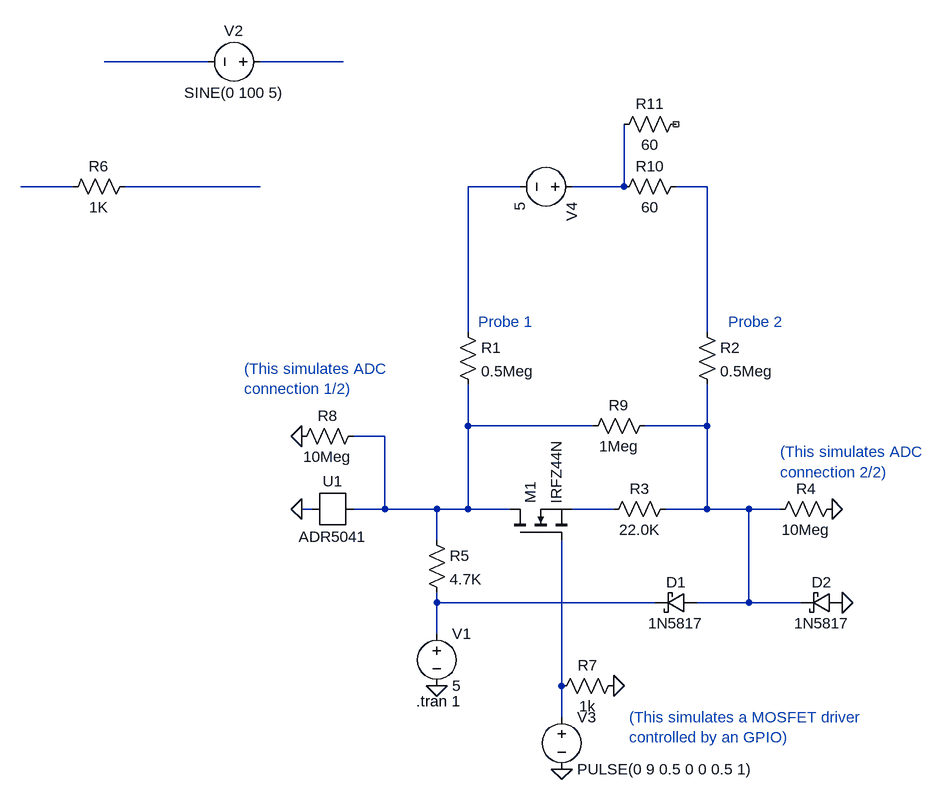
[diagram p0: schematic Voltmeter W Continuity.asc]
Voltmeter W Continuity.asc, the LTspice schematic file:
Version 4
SHEET 1 880 680
WIRE -384 -752 -544 -752
WIRE -176 -752 -304 -752
WIRE -592 -560 -672 -560
WIRE -304 -560 -512 -560
WIRE 96 -560 16 -560
WIRE 256 -560 256 -656
WIRE 256 -560 176 -560
WIRE 384 -560 336 -560
WIRE 16 -336 16 -560
WIRE 384 -336 384 -560
WIRE 16 -192 16 -256
WIRE 208 -192 16 -192
WIRE 384 -192 384 -256
WIRE 384 -192 288 -192
WIRE -112 -176 -160 -176
WIRE -224 -64 -240 -64
WIRE -112 -64 -112 -176
WIRE -112 -64 -160 -64
WIRE -32 -64 -112 -64
WIRE 16 -64 16 -192
WIRE 16 -64 -32 -64
WIRE 80 -64 16 -64
WIRE 240 -64 176 -64
WIRE 384 -64 384 -192
WIRE 384 -64 320 -64
WIRE 448 -64 384 -64
WIRE 496 -64 448 -64
WIRE -32 -16 -32 -64
WIRE -32 80 -32 64
WIRE 304 80 -32 80
WIRE 448 80 448 -64
WIRE 448 80 368 80
WIRE 528 80 448 80
WIRE -32 128 -32 80
WIRE 160 208 160 -16
WIRE 160 256 160 208
FLAG -32 208 0
FLAG 576 -64 0
FLAG -240 -64 0
FLAG 592 80 0
FLAG 240 208 0
FLAG 160 336 0
FLAG -240 -176 0
SYMBOL voltage -32 112 R0
WINDOW 123 0 0 Left 0
WINDOW 39 0 0 Left 0
SYMATTR InstName V1
SYMATTR Value 5
SYMBOL res 0 -352 R0
SYMATTR InstName R1
SYMATTR Value 0.5Meg
SYMBOL res 368 -352 R0
SYMATTR InstName R2
SYMATTR Value 0.5Meg
SYMBOL res 224 -48 R270
WINDOW 0 32 56 VTop 2
WINDOW 3 0 56 VBottom 2
SYMATTR InstName R3
SYMATTR Value 22.0K
SYMBOL res 592 -80 R90
WINDOW 0 0 56 VBottom 2
WINDOW 3 32 56 VTop 2
SYMATTR InstName R4
SYMATTR Value 10Meg
SYMBOL References\\ADR5041 -192 -64 R90
WINDOW 3 27 0 VTop 2
WINDOW 0 -27 0 VBottom 2
SYMATTR InstName U1
SYMBOL voltage -288 -752 R90
WINDOW 0 -32 56 VBottom 2
WINDOW 3 32 56 VTop 2
WINDOW 123 0 0 Left 0
WINDOW 39 0 0 Left 0
SYMATTR InstName V2
SYMATTR Value SINE(0 100 5)
SYMBOL res -48 -32 R0
SYMATTR InstName R5
SYMATTR Value 4.7K
SYMBOL schottky 368 64 R90
WINDOW 0 0 32 VBottom 2
WINDOW 3 32 32 VTop 2
SYMATTR InstName D1
SYMATTR Value 1N5817
SYMATTR Description Diode
SYMATTR Type diode
SYMBOL schottky 592 64 R90
WINDOW 0 0 32 VBottom 2
WINDOW 3 32 32 VTop 2
SYMATTR InstName D2
SYMATTR Value 1N5817
SYMATTR Description Diode
SYMATTR Type diode
SYMBOL res -496 -576 R90
WINDOW 0 0 56 VBottom 2
WINDOW 3 32 56 VTop 2
SYMATTR InstName R6
SYMATTR Value 1K
SYMBOL nmos 80 -16 R270
SYMATTR InstName M1
SYMATTR Value IRFZ44N
SYMBOL voltage 160 240 R0
WINDOW 123 0 0 Left 0
WINDOW 39 0 0 Left 0
SYMATTR InstName V3
SYMATTR Value PULSE(0 9 0.5 0 0 0.5 1)
SYMBOL res 256 192 R90
WINDOW 0 0 56 VBottom 2
WINDOW 3 32 56 VTop 2
SYMATTR InstName R7
SYMATTR Value 1k
SYMBOL res -256 -160 R270
WINDOW 0 32 56 VTop 2
WINDOW 3 0 56 VBottom 2
SYMATTR InstName R8
SYMATTR Value 10Meg
SYMBOL res 304 -208 R90
WINDOW 0 0 56 VBottom 2
WINDOW 3 32 56 VTop 2
SYMATTR InstName R9
SYMATTR Value 1Meg
SYMBOL res 352 -576 R90
WINDOW 0 0 56 VBottom 2
WINDOW 3 32 56 VTop 2
SYMATTR InstName R10
SYMATTR Value 60
SYMBOL voltage 192 -560 R90
WINDOW 123 0 0 Left 0
WINDOW 39 0 0 Left 0
SYMATTR InstName V4
SYMATTR Value 5
SYMBOL res 352 -672 R90
WINDOW 0 0 56 VBottom 2
WINDOW 3 32 56 VTop 2
SYMATTR InstName R11
SYMATTR Value 60
TEXT -64 232 Left 2 !.tran 1
TEXT 264 256 Left 2 ;(This simulates a MOSFET driver\ncontrolled by an GPIO)
TEXT 496 -152 Left 2 ;(This simulates ADC \nconnection 2/2)
TEXT -328 -280 Left 2 ;(This simulates ADC \nconnection 1/2)
TEXT 32 -352 Left 2 ;Probe 1
TEXT 416 -352 Left 2 ;Probe 2

The netlist it stands for:
* Voltmeter W Continuity.asc
V1 N011 0 5
R1 N005 N008 0.5Meg
R2 N007 N009 0.5Meg
R3 N010 N009 22.0K
R4 0 N009 10Meg
XU1 N008 0 ADR5041
V2 N002 N001 SINE(0 100 5)
R5 N008 N011 4.7K
D1 N009 N011 1N5817
D2 0 N009 1N5817
R6 N004 N003 1K
M1 N008 N012 N010 N010 IRFZ44N
V3 N012 0 PULSE(0 9 0.5 0 0 0.5 1)
R7 0 N012 1k
R8 0 N008 10Meg
R9 N009 N008 1Meg
R10 N007 N006 60
V4 N006 N005 5
R11 NC_01 N006 60
.model D D
.lib standard.dio
.model NMOS NMOS
.model PMOS PMOS
.lib standard.mos
.tran 1
* (This simulates a MOSFET driver
* controlled by an GPIO)
* (This simulates ADC
* connection 2/2)
* (This simulates ADC
* connection 1/2)
* Probe 1
* Probe 2
.lib ADR5041.sub
.backanno
.end